# EasyEDA schematic WH_Test_Station_Schematic_RevA.json
TITLE: Embedded Hardware for Control, Data Acquisition and AC Monitoring; REV: 1.0; Date: 2025-05-15; Sheet: 1/1; Drawn By: Nawaf Altalhi; Company: PSU Power Lab
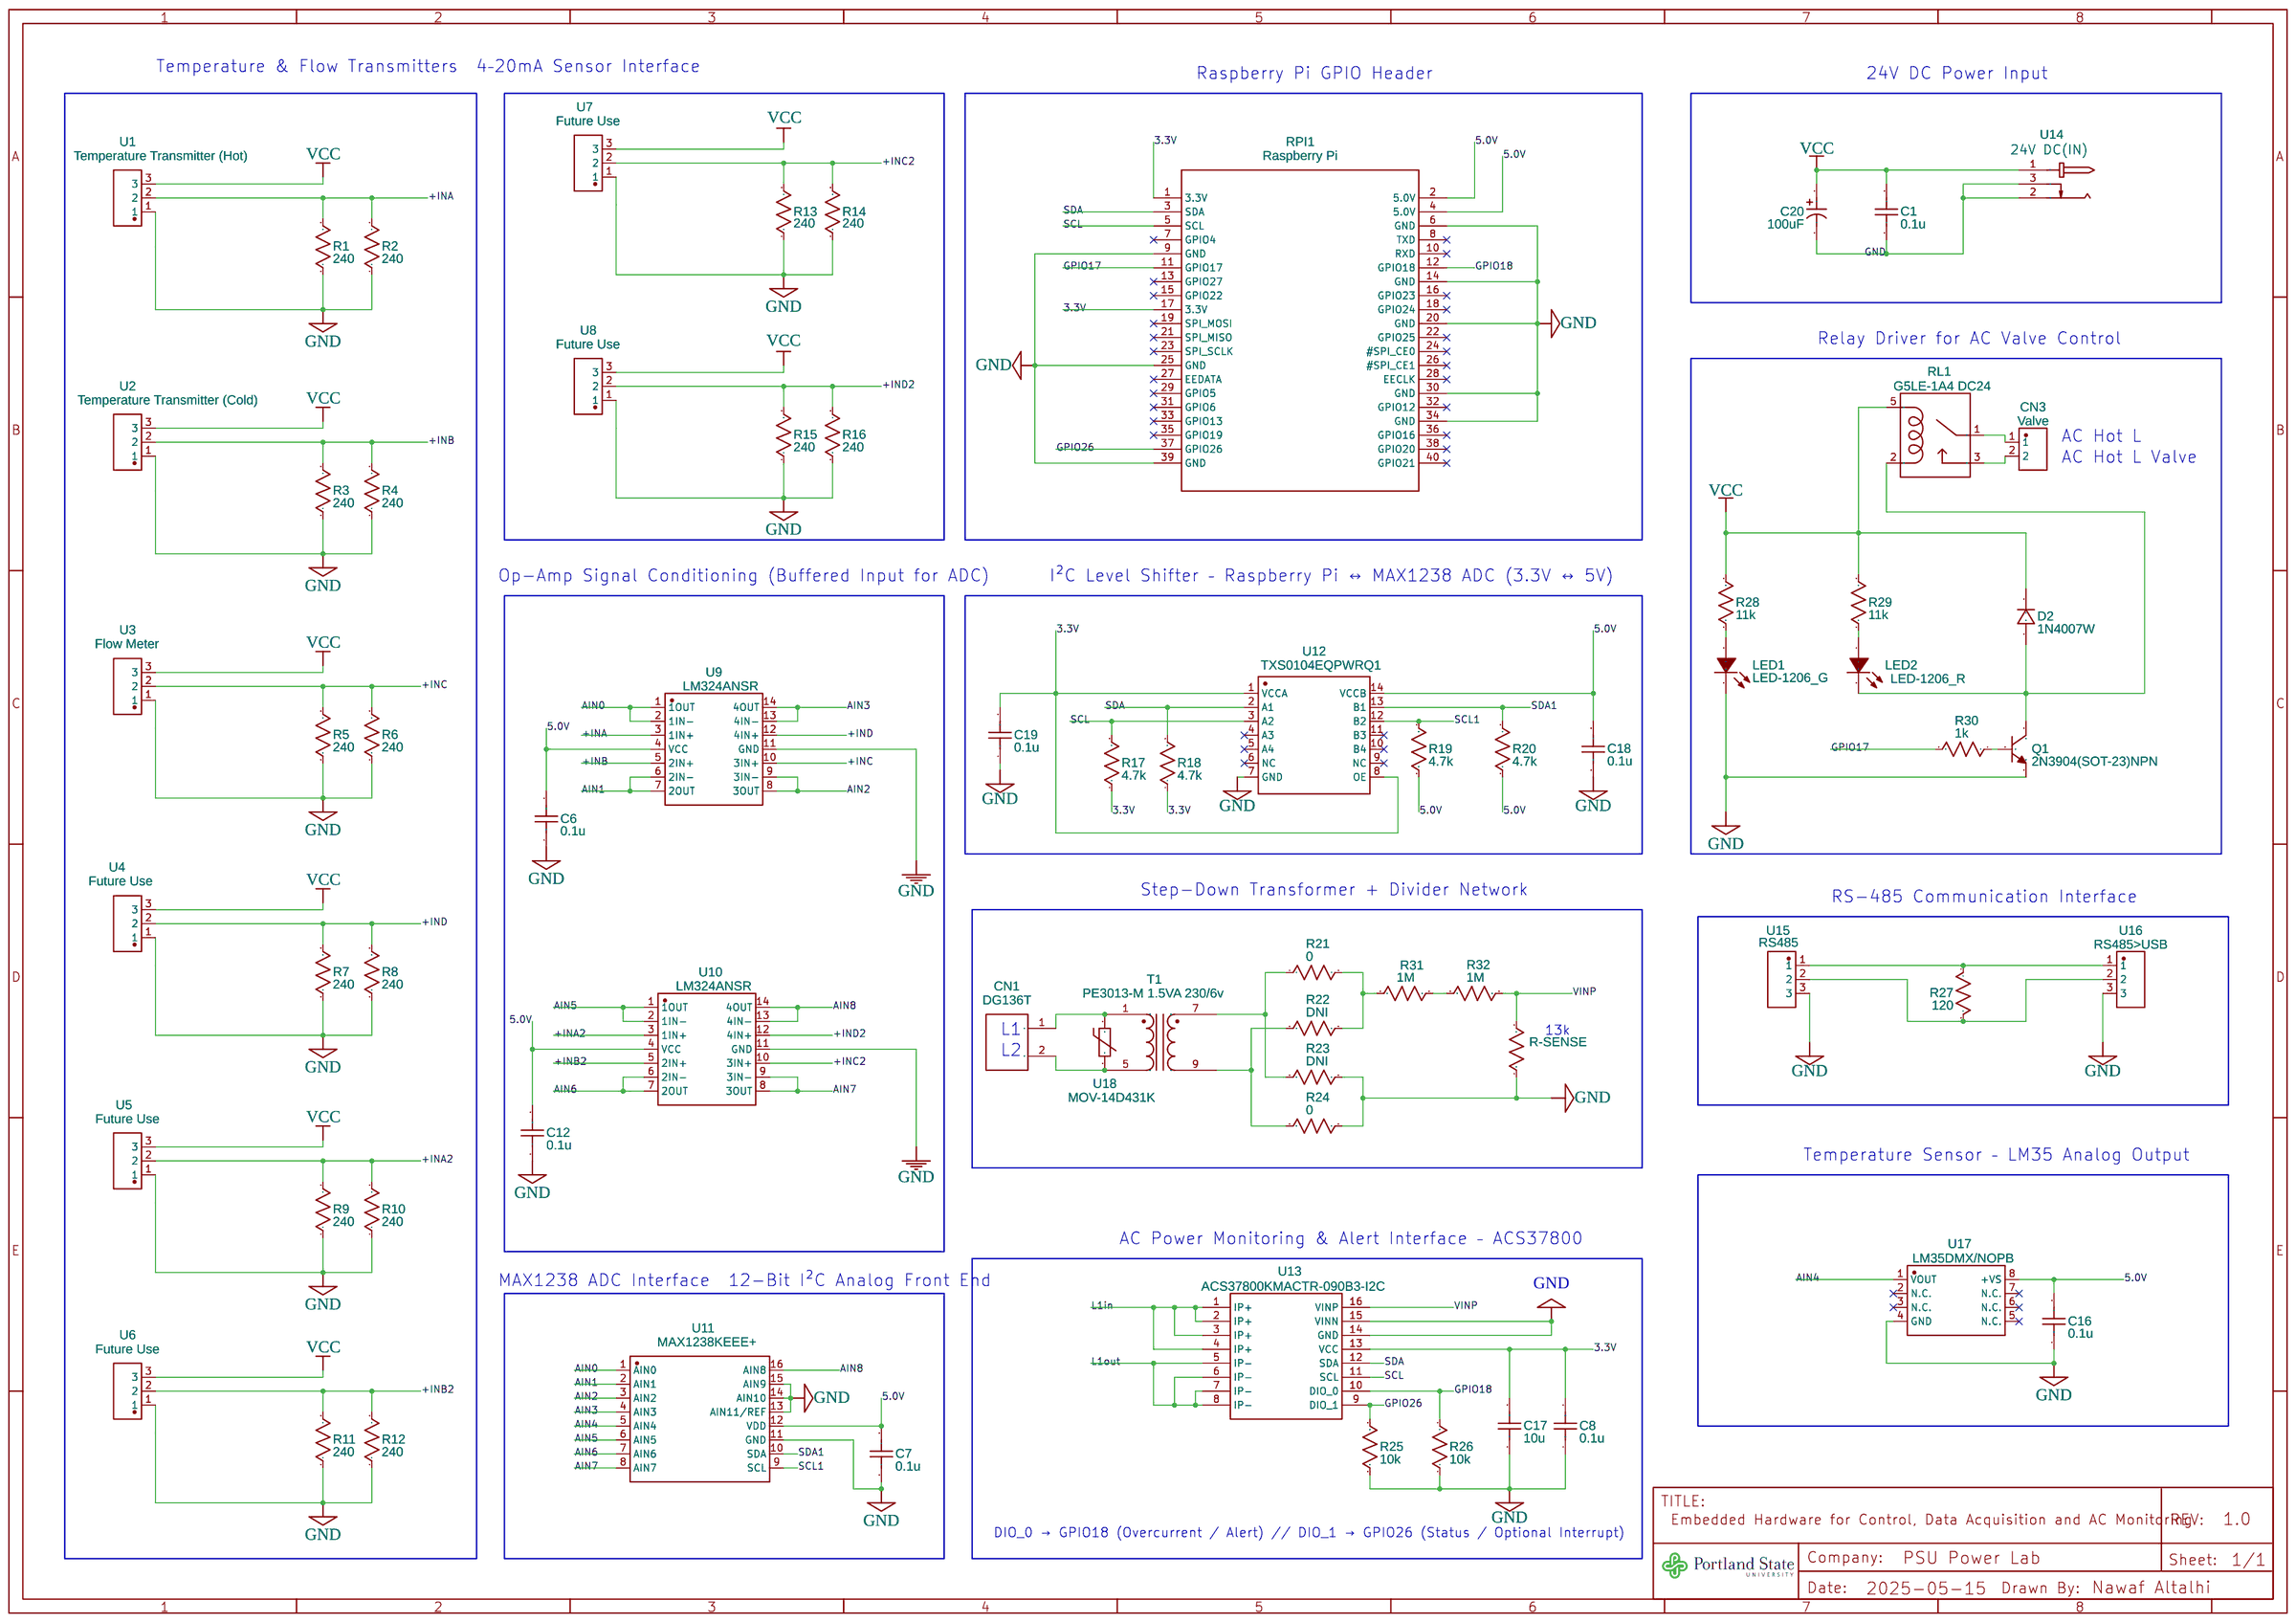
[diagram p0: schematic sheet]

## Parts
C1  0.1u  [C1206]
C6  0.1u  [C1206]
C7  0.1u  [C1206]
C8  0.1u  [C1206]
C12  0.1u  [C1206]
C16  0.1u  [C1206]
C17  10u  [C1206]
C18  0.1u  [C1206]
C19  0.1u  [C1206]
C20  100uF  [CAP-SMD_BD6.3-L6.6-W6.6-LS7.6-RD]
CN1  DG136T  [DG136T-12.7-2P]
CN3  Valve  [CONN-TH_2P-P6.35_DBT50G-6.35-2P-BK-P]
D2  1N4007W  [SOD-123_L2.8-W1.8-LS3.7-RD]
LED1  LED-1206_G  [LED1206-RD_GREEN]
LED2  LED-1206_R  [LED1206-RD-R_RED]
Q1  2N3904(SOT-23)NPN  [SOT-23-3_L2.9-W1.3-P1.90-LS2.4-TR]
R1  240  [R1206]
R2  240  [R1206]
R3  240  [R1206]
R4  240  [R1206]
R5  240  [R1206]
R6  240  [R1206]
R7  240  [R1206]
R8  240  [R1206]
R9  240  [R1206]
R10  240  [R1206]
R11  240  [R1206]
R12  240  [R1206]
R13  240  [R1206]
R14  240  [R1206]
R15  240  [R1206]
R16  240  [R1206]
R17  4.7k  [R1206]
R18  4.7k  [R1206]
R19  4.7k  [R1206]
R20  4.7k  [R1206]
R21  0  [R1206]
R22  DNI  [R1206]
R23  DNI  [R1206]
R24  0  [R1206]
R25  10k  [R1206]
R26  10k  [R1206]
R27  120  [R1206]
R28  11k  [R1206]
R29  11k  [R1206]
R30  1k  [R1206]
R31  1M  [R1206]
R32  1M  [R1206]
R-SENSE  13k  [R1206]
RL1  G5LE-1A4 DC24  [RELAY-TH_G5LE-1A4-XXXX]
RPI1  Raspberry Pi  [RASPERRY_PI_GPIOS]
T1  PE3013-M 1.5VA 230/6v  [PE3013-M]
U1  Temperature Transmitter (Hot)  [CONN-TH_DB301V-3.5-3P-GN]
U2  Temperature Transmitter (Cold)  [CONN-TH_DB301V-3.5-3P-GN]
U3  Flow Meter  [CONN-TH_DB301V-3.5-3P-GN]
U4  Future Use  [CONN-TH_DB301V-3.5-3P-GN]
U5  Future Use  [CONN-TH_DB301V-3.5-3P-GN]
U6  Future Use  [CONN-TH_DB301V-3.5-3P-GN]
U7  Future Use  [CONN-TH_DB301V-3.5-3P-GN]
U8  Future Use  [CONN-TH_DB301V-3.5-3P-GN]
U9  LM324ANSR  [SOIC-14_L10.0-W5.5-P1.27-LS7.8-BL]
U10  LM324ANSR  [SOIC-14_L10.0-W5.5-P1.27-LS7.8-BL]
U11  MAX1238KEEE+  [QSOP-16_L4.9-W3.9-P0.64-LS6.0-BL]
U12  TXS0104EQPWRQ1  [TSSOP-14_L5.0-W4.4-P0.65-LS6.4-TL]
U13  ACS37800KMACTR-090B3-I2C  [ACS37800_CONNECTOR]
U14  24 V DC(IN)  [DC-IN-TH_XDJK-0051-025]
U15  RS485  [CONN-TH_DB301V-3.5-3P-GN]
U16  RS485>USB  [CONN-TH_DB301V-3.5-3P-GN]
U17  LM35DMX/NOPB  [SOIC-8_L4.9-W3.9-P1.27-LS6.0-BL]
U18  MOV-14D431K  [RES-TH_L16.5-W5.6-P7.50-D1.2-S3.00]

## Library data of the parts
C1 C6-C8 C12 C16-C19 = C_0603_US: Contributor: LCEDA_Lib
C20 = RVT1H101M0607: Supplier: LCSC; Supplier Part: C3151829; Manufacturer: ROQANG(容强); Contributor: lcsc; JLCPCB Part Class: Extended Part
CN1 = DG136T_2W_x12.7_Terminals: Manufacturer Part: Degson; Contributor: Sparkytearle; Supplier Part: DG136T-12.7-02P; Supplier: TME
CN3 = DBT50G-6.35-2P-BK-P OGC: Supplier: LCSC; Supplier Part: C5179471; Manufacturer: DORABO(地博电气); JLCPCB Part Class: Extended Part; Contributor: lcsc
D2 = 1N4007W: Supplier: LCSC; Supplier Part: C328592; Manufacturer: BLUE ROCKET; Contributor: LCEDA_Lib
LED1 = LED-0603_G: Manufacturer: EVERLIGHT(台湾亿光); Manufacturer Part: 19-217/GHC-YR1S2/3T; Supplier Part: C72043; Supplier: LCSC; Contributor: LCEDA_Lib
LED2 = LED-0603_R: Manufacturer: EVERLIGHT(台湾亿光); Manufacturer Part: 19-217/R6C-AL1M2VY/3T; Supplier Part: C72044; Supplier: LCSC; Contributor: LCEDA_01
Q1 = 2N3904(SOT-23): Supplier: LCSC; Manufacturer: KEC; Manufacturer Part: 2n3904S-RTK/PS; Supplier Part: C18536; Paste Type: SOT-23; Contributor: LCEDA_Lib
R1-R32 R-SENSE = R_0603_US: Contributor: LCEDA_Lib
RL1 = G5LE-1A4 DC24: Contributor: LCSC; Supplier: LCSC; Supplier Part: C152708; Manufacturer: OMRON(欧姆龙); JLCPCB Part Class: Extended Part
RPI1 = PiTFT 2.2: sourceId: vnhasKEWe; Package Display: No
T1 = PE3013-M 1.5VA 230/6v: Contributor: KiCAD; license: https://www.gnu.org/licenses/lgpl-2.1.html
U1-U8 U15 U16 = DB301V-3.5-3P-GN: Contributor: LCSC; Supplier: LCSC; Supplier Part: C695630; Manufacturer: DORABO(地博电气); Manufacturer Part: DB301V-3.5-3P-GN-S; JLCPCB Part Class: Extended Part
U9 U10 = LM324ANSR: Supplier: LCSC; Manufacturer: TI(德州仪器); Supplier Part: C111853; JLCPCB Part Class: Extended Part; link: https://lcsc.com/eda_search?q=C111853&%26type=1&ref=editor
U11 = MAX1239KEEE+: Contributor: LCSC; Supplier: LCSC; Supplier Part: C1542990; Manufacturer: ADI(亚德诺)/MAXIM(美信); JLCPCB Part Class: Extended Part
U12 = TXS0104EQPWRQ1: Contributor: LCSC; Supplier: LCSC; Supplier Part: C2652953; Manufacturer: TI(德州仪器); JLCPCB Part Class: Extended Part; link: https://lcsc.com/eda_search?q=C2652953&%26type=1&ref=editor
U13 = ACS37800KMACTR-030B3-I2C COPY: Manufacturer: Allegro microsystems; Manufacturer Part: ACS37800KMACTR-030B3-I2C; Supplier: Mouser; Supplier Part: 250-KMACTR-030B3-I2C; link: https://hr.mouser.com/ProductDetail/Allegro-MicroSystems/ACS37800KMACTR-030B3-I2C?qs=e8oIoAS2J1T%2FXN2DlQrWmw%3D%3D; Contributor: Ivan Pavelic; Package Display: No
U14 = XDJK-0051-025: Supplier: LCSC; Supplier Part: C7498153; Manufacturer: LX(连欣科技); JLCPCB Part Class: Extended Part
U17 = LM35DMX/NOPB: Contributor: LCSC; Supplier: LCSC; Supplier Part: C2683367; Manufacturer: TI(德州仪器); JLCPCB Part Class: Extended Part
U18 = MOV-14D431K: Supplier: LCSC; Supplier Part: C1527438; Manufacturer: BOURNS; JLCPCB Part Class: Extended Part; Contributor: lcsc

## Nets
3.3V: C8.2 C17.2 C19.2 R17.1 R18.1 RPI1.1(3.3V) RPI1.17(3.3V) U12.1(VCCA) U12.8(OE) U13.13(VCC)
5.0V: C6.2 C7.2 C12.2 C16.2 C18.2 R19.1 R20.1 RPI1.2(5.0V) RPI1.4(5.0V) U9.4(VCC) U10.4(VCC) U11.12(VDD) U12.14(VCCB) U17.8(+VS)
GND: C1.1 C6.1 C7.1 C8.1 C12.1 C16.1 C17.1 C18.1 C19.1 C20.2 LED1.2 Q1.1(E) R1.1 R2.1 R3.1 R4.1 R5.1 R6.1 R7.1 R8.1 R9.1 R10.1 R11.1 R12.1 R13.1 R14.1 R15.1 R16.1 R23.2 R24.2 R25.1 R26.1 R-SENSE.1 RPI1.6(GND) RPI1.9(GND) RPI1.14(GND) RPI1.20(GND) RPI1.25(GND) RPI1.30(GND) RPI1.34(GND) RPI1.39(GND) U1.1 U2.1 U3.1 U4.1 U5.1 U6.1 U7.1 U8.1 U9.11(GND) U10.11(GND) U11.11(GND) U11.13(AIN11/REF) U11.14(AIN10) U11.15(AIN9) U12.7(GND) U13.14(GND) U13.15(VINN) U14.2 U14.3 U15.3 U16.3 U17.4(GND)
VCC: C1.2 C20.1 D2.1 R28.2 R29.2 RL1.5(COIL1) U1.3 U2.3 U3.3 U4.3 U5.3 U6.3 U7.3 U8.3 U14.1
VINP: R32.2 R-SENSE.2 U13.16(VINP)
+INA: R1.2 R2.2 U1.2 U9.3(1IN+)
+INA2: R9.2 R10.2 U5.2 U10.3(1IN+)
+INB: R3.2 R4.2 U2.2 U9.5(2IN+)
+INB2: R11.2 R12.2 U6.2 U10.5(2IN+)
+INC: R5.2 R6.2 U3.2 U9.10(3IN+)
+INC2: R13.2 R14.2 U7.2 U10.10(3IN+)
+IND: R7.2 R8.2 U4.2 U9.12(4IN+)
+IND2: R15.2 R16.2 U8.2 U10.12(4IN+)
AIN0: U9.1(1OUT) U9.2(1IN-) U11.1(AIN0)
AIN1: U9.6(2IN-) U9.7(2OUT) U11.2(AIN1)
AIN2: U9.8(3OUT) U9.9(3IN-) U11.3(AIN2)
AIN3: U9.13(4IN-) U9.14(4OUT) U11.4(AIN3)
AIN4: U11.5(AIN4) U17.1(VOUT)
AIN5: U10.1(1OUT) U10.2(1IN-) U11.6(AIN5)
AIN6: U10.6(2IN-) U10.7(2OUT) U11.7(AIN6)
AIN7: U10.8(3OUT) U10.9(3IN-) U11.8(AIN7)
AIN8: U10.13(4IN-) U10.14(4OUT) U11.16(AIN8)
GPIO17: R30.2 RPI1.11(GPIO17)
GPIO18: R26.2 RPI1.12(GPIO18) U13.10(DIO_0)
GPIO26: R25.2 RPI1.37(GPIO26) U13.9(DIO_1)
L1in: U13.1(IP+) U13.2(IP+) U13.3(IP+) U13.4(IP+)
L1out: U13.5(IP-) U13.6(IP-) U13.7(IP-) U13.8(IP-)
SCL: R17.2 RPI1.5(SCL) U12.3(A2) U13.11(SCL)
SCL1: R19.2 U11.9(SCL) U12.12(B2)
SDA: R18.2 RPI1.3(SDA) U12.2(A1) U13.12(SDA)
SDA1: R20.2 U11.10(SDA) U12.13(B1)
Net-(CN1-1): CN1.1 T1.1(PA) U18.1
Net-(CN1-2): CN1.2 T1.5(PB) U18.2
Net-(CN3-1): CN3.1 RL1.1(MAIN)
Net-(CN3-2): CN3.2 RL1.3(NO)
Net-(D2-2): D2.2 LED2.2 Q1.3(C) RL1.2(COIL2)
Net-(LED1-1): LED1.1 R28.1
Net-(LED2-1): LED2.1 R29.1
Net-(Q1-2): Q1.2(B) R30.1
Net-(R21-1): R21.1 R23.1 T1.7(SA)
Net-(R21-2): R21.2 R22.2 R31.1
Net-(R22-1): R22.1 R24.1 T1.9(SB)
Net-(R27-1): R27.1 U15.1 U16.1
Net-(R27-2): R27.2 U15.2 U16.2
Net-(R31-2): R31.2 R32.1

Not connected (* = marked no-connect by the designer): RPI1 7(GPIO4)* 8(TXD)* 10(RXD)* 13(GPIO27)* 15(GPIO22)* 16(GPIO23)* 18(GPIO24)* 19(SPI_MOSI)* 21(SPI_MISO)* 22(GPIO25)* 23(SPI_SCLK)* 24(#SPI_CE0)* 26(#SPI_CE1)* 27(EEDATA)* 28(EECLK)* 29(GPIO5)* 31(GPIO6)* 32(GPIO12)* 33(GPIO13)* 35(GPIO19)* 36(GPIO16)* 38(GPIO20)* 40(GPIO21)*; U12 4(A3)* 5(A4)* 6(NC)* 9(NC)* 10(B4)* 11(B3)*; U17 2(N.C.)* 3(N.C.)* 5(N.C.)* 6(N.C.)* 7(N.C.)*

## Notes on the sheet
- Temperature & Flow Transmitters  4–20 mA Sensor Interface
- Raspberry Pi GPIO Header
- 24 V DC Power Input
- Relay Driver for AC Valve Control
- AC Hot L
- AC Hot L Valve
- Op-Amp Signal Conditioning (Buffered Input for ADC)
- I²C Level Shifter – Raspberry Pi ↔ MAX1238 ADC (3.3 V ↔ 5 V)
- Step-Down Transformer + Divider Network
- RS-485 Communication Interface
- L1
- 13k
- L2
- Temperature Sensor – LM35 Analog Output
- AC Power Monitoring & Alert Interface – ACS37800
- MAX1238 ADC Interface  12-Bit I²C Analog Front End
- DIO_0 → GPIO18 (Overcurrent / Alert) // DIO_1 → GPIO26 (Status / Optional Interrupt)
